# EAGLE design IR_SENSOR PCB design (EAGLE 7.2.0)
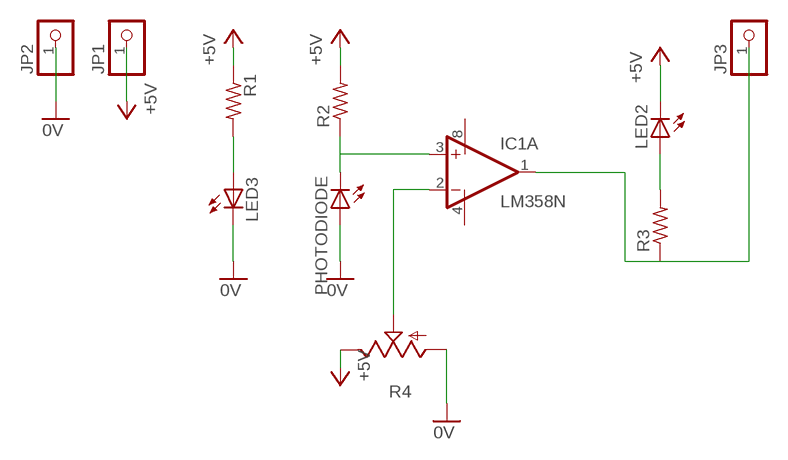
[diagram p0: schematic, sheet 1]

## Parts
IC1  LM358N  [DIL08]
JP1  PINHD-1X1  [1X01]
JP2  PINHD-1X1  [1X01]
JP3  PINHD-1X1  [1X01]
LED2  LED3MM  [LED3MM]
LED3  LED3MM  [LED3MM]
PHOTODIODE  LED3MM  [LED3MM]
R1  R-US_0207/10  [0207/10]
R2  R-US_0207/10  [0207/10]
R3  R-US_0207/10  [0207/10]
R4  TRIM_US-B25U  [B25U]

## Nets
0V: JP2.1 LED3.K(C) PHOTODIODE.A R4.A
+5V: JP1.1 LED2.K(C) R1.1 R2.2 R4.E
N$1: IC1.3(A:+IN) PHOTODIODE.K(C) R2.1
N$2: IC1.2(A:-IN) R4.S
N$3: LED3.A R1.2
N$4: LED2.A R3.2
N$5: IC1.1(A:OUT) JP3.1 R3.1
Unconnected: IC1.5(B:+IN) IC1.6(B:-IN) IC1.7(B:OUT)

## Power pins joined to a net without a drawn wire
V+: IC1.8(P:V+)
V-: IC1.4(P:V-)

## Library data of the parts
IC1 = linear:LM358: OP AMP also LM158; LM258; LM2904 Source: http://cache.national.com/ds/LM/LM158.pdf
JP1-JP3 = pinhead:PINHD-1X1: PIN HEADER
LED2 LED3 PHOTODIODE = led:LED: LED OSRAM: - CHIPLED LG R971, LG N971, LY N971, LG Q971, LY Q971, LO R971, LY R971 LH N974, LH R974 LS Q976, LO Q976, LY Q976 LO Q996 - Hyper CHIPLED LW Q18S LB Q993, LB Q99A, LB R99A - SideLED LS A670, LO A670, LY A670, LG A670, LP A670 LB A673, LV A673, LT A673, LW A673 LH A674 LY A675 LS A676, LA A676, LO A676, LY A676, LW A676 LS A679, LY A679, LG A679 - Hyper Micro SIDELED® LS Y876, LA Y876, LO Y876, LY Y876 LT Y87S - SmartLED LW L88C, LW L88S LB L89C, LB L89S, LG L890 LS L89K, LO L89K, LY L89K LS L896, LA L896, LO L896, LY L896 - TOPLED LS T670, LO T670, LY T670, LG T670, LP T670 LSG T670, LSP T670, LSY T670, LOP T670, LYG T670 LG T671, LOG T671, LSG T671 LB T673, LV T673, LT T673, LW T673 LH T674 LS T676, LA T676, LO T676, LY T676, LB T676, LH T676, LSB T676, LW T676 LB T67C, LV T67C, LT T67C, LS T67K, LO T67K, LY T67K, LW E67C LS E67B, LA E67B, LO E67B, LY E67B, LB E67C, LV E67C, LT E67C LW T67C LS T679, LY T679, LG T679 LS T770, LO T770, LY T770, LG T770, LP T770 LB T773, LV T773, LT T773, LW T773 LH T774 LS E675, LA E675, LY E675, LS T675 LS T776, LA T776, LO T776, LY T776, LB T776 LHGB T686 LT T68C, LB T68C - Hyper Mini TOPLED® LB M676 - Mini TOPLED Santana® LG M470 LS M47K, LO M47K, LY M47K Source: http://www.osram.convergy.de LUXEON: - LUMILED® LXK2-PW12-R00, LXK2-PW12-S00, LXK2-PW14-U00, LXK2-PW14-V00 LXK2-PM12-R00, LXK2-PM12-S00, LXK2-PM14-U00 LXK2-PE12-Q00, LXK2-PE12-R00, LXK2-PE12-S00, LXK2-PE14-T00, LXK2-PE14-U00 LXK2-PB12-K00, LXK2-PB12-L00, LXK2-PB12-M00, LXK2-PB14-N00, LXK2-PB14-P00, LXK2-PB14-Q00 LXK2-PR12-L00, LXK2-PR12-M00, LXK2-PR14-Q00, LXK2-PR14-R00 LXK2-PD12-Q00, LXK2-PD12-R00, LXK2-PD12-S00 LXK2-PH12-R00, LXK2-PH12-S00 LXK2-PL12-P00, LXK2-PL12-Q00, LXK2-PL12-R00 Source: www.luxeon.com KINGBRIGHT: KA-3528ASYC Source: www.kingbright.com
R1-R3 = rcl:R-US_: RESISTOR, American symbol
R4 = pot:TRIM_US-: POTENTIOMETER

## Board
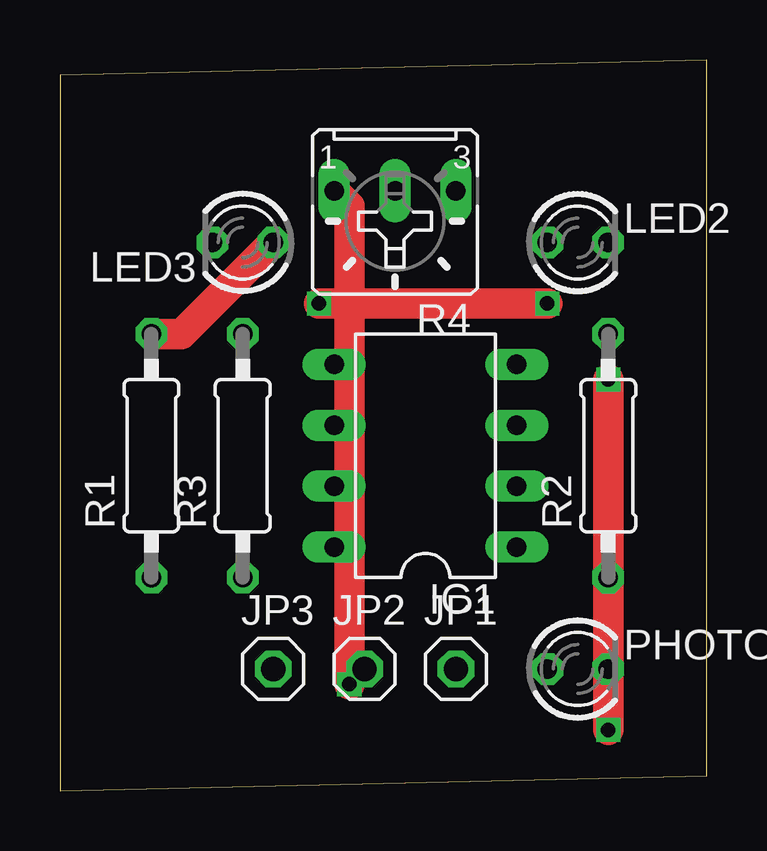
[diagram p1: board, top side]
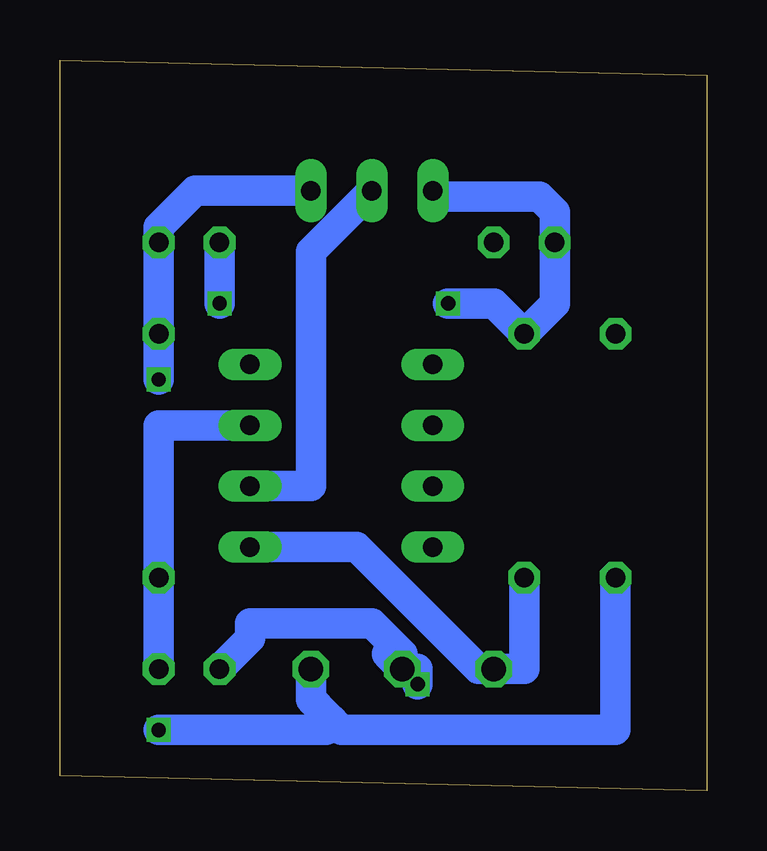
[diagram p2: board, bottom side, seen from below]

Size 26.98 x 30.47 mm. Coordinates in mm from the lower left corner, seen from the top.
Outline: 0,0 26.98,0.64 26.98,30.47 0,29.84 0,0
Copper layers (1*16): Top 0.035mm / dielectric 1.5mm / Bottom 0.035mm
Design rules "default": minimum track width 10mil, minimum drill 24mil, track to track 8mil, track to pad 8mil, pad to pad 8mil, via to via 8mil, smd to smd 8mil, copper to edge 40mil, drill to drill 8mil, minimum pad ring 10mil, minimum via ring 8mil, stop-mask expansion 4mil, vias tented up to drill 0mil, thermal gap 10mil

### Footprints (pad centres in the part's own frame; a part is rotated, then mirrored left to right if it is on the bottom)
DIL08 = drill 0.813 long: 1 -3.81,-3.81; 2 -1.27,-3.81; 3 1.27,-3.81; 4 3.81,-3.81; 5 3.81,3.81; 6 1.27,3.81; 7 -1.27,3.81; 8 -3.81,3.81
1X01 = drill 1.016 octagon: 1 0,0
LED3MM = drill 0.813 octagon: A -1.27,0; K 1.27,0
0207/10 = drill 0.813 octagon: 1 -5.08,0; 2 5.08,0
B25U = drill 0.813 long: A 2.54,-0.889; E -2.54,-0.889; S 0,-0.889

### Placement (x,y rotation side)
IC1  15.24,13.97 90 top
JP1  16.51,5.08 0 top
JP2  12.7,5.08 0 top
JP3  8.89,5.08 0 top
LED2  21.59,22.86 0 top
LED3  7.62,22.86 180 top
PHOTODIODE  21.59,5.08 0 top
R1  3.81,13.97 90 top
R2  22.86,13.97 90 top
R3  7.62,13.97 90 top
R4  13.97,24.13 180 top

### Tracks (layer width: path | path; a pad name or v marks a point on that pad's centre or on a via)
0V  (via drill 0.6)
  Top 1.27: v12.06,4.45 12.06,24.38 R4.A
  Bottom 1.27: R4.A 11.18,24.77 6.99,24.77 6.35,24.13 LED3.K 6.35,20.32 7.62,19.05 | JP2.1 12.7,5.71 13.97,6.99 19.05,6.99 19.05,6.35 PHOTODIODE.A | 13.34,5.71 JP2.1 | JP2.1 12.06,5.08 v12.06,4.45
+5V  (via drill 0.6)
  Top 1.27: v22.86,2.54 v22.86,17.14
  Bottom 1.27: R4.E 21.34,25.02 22.86,23.5 LED2.K R2.2 v22.86,17.14 | 15.88,3.17 15.56,2.86 | 15.56,2.86 15.24,2.54 3.81,2.54 R1.1 | 15.88,2.54 15.56,2.86 | 16.51,4.45 JP1.1 16.51,3.81 15.88,3.17 | 15.88,3.17 15.88,2.54 | 15.88,2.54 v22.86,2.54
N$1
  Bottom 1.27: IC1.3 22.86,15.24 R2.1 PHOTODIODE.K
N$2
  Bottom 1.27: IC1.2 16.51,12.7 16.51,22.48 R4.S
N$3
  Top 1.27: R1.2 5.08,19.05 LED3.A
N$4  (via drill 0.6)
  Top 1.27: v20.32,20.32 v10.79,20.32
  Bottom 1.27: LED2.A v20.32,20.32 | v10.79,20.32 8.89,20.32 R3.2
N$5
  Bottom 1.27: R3.1 7.62,5.08 JP3.1 9.53,5.08 14.61,10.16 IC1.1